# Altium schematic sheet main.SchDoc
size A3
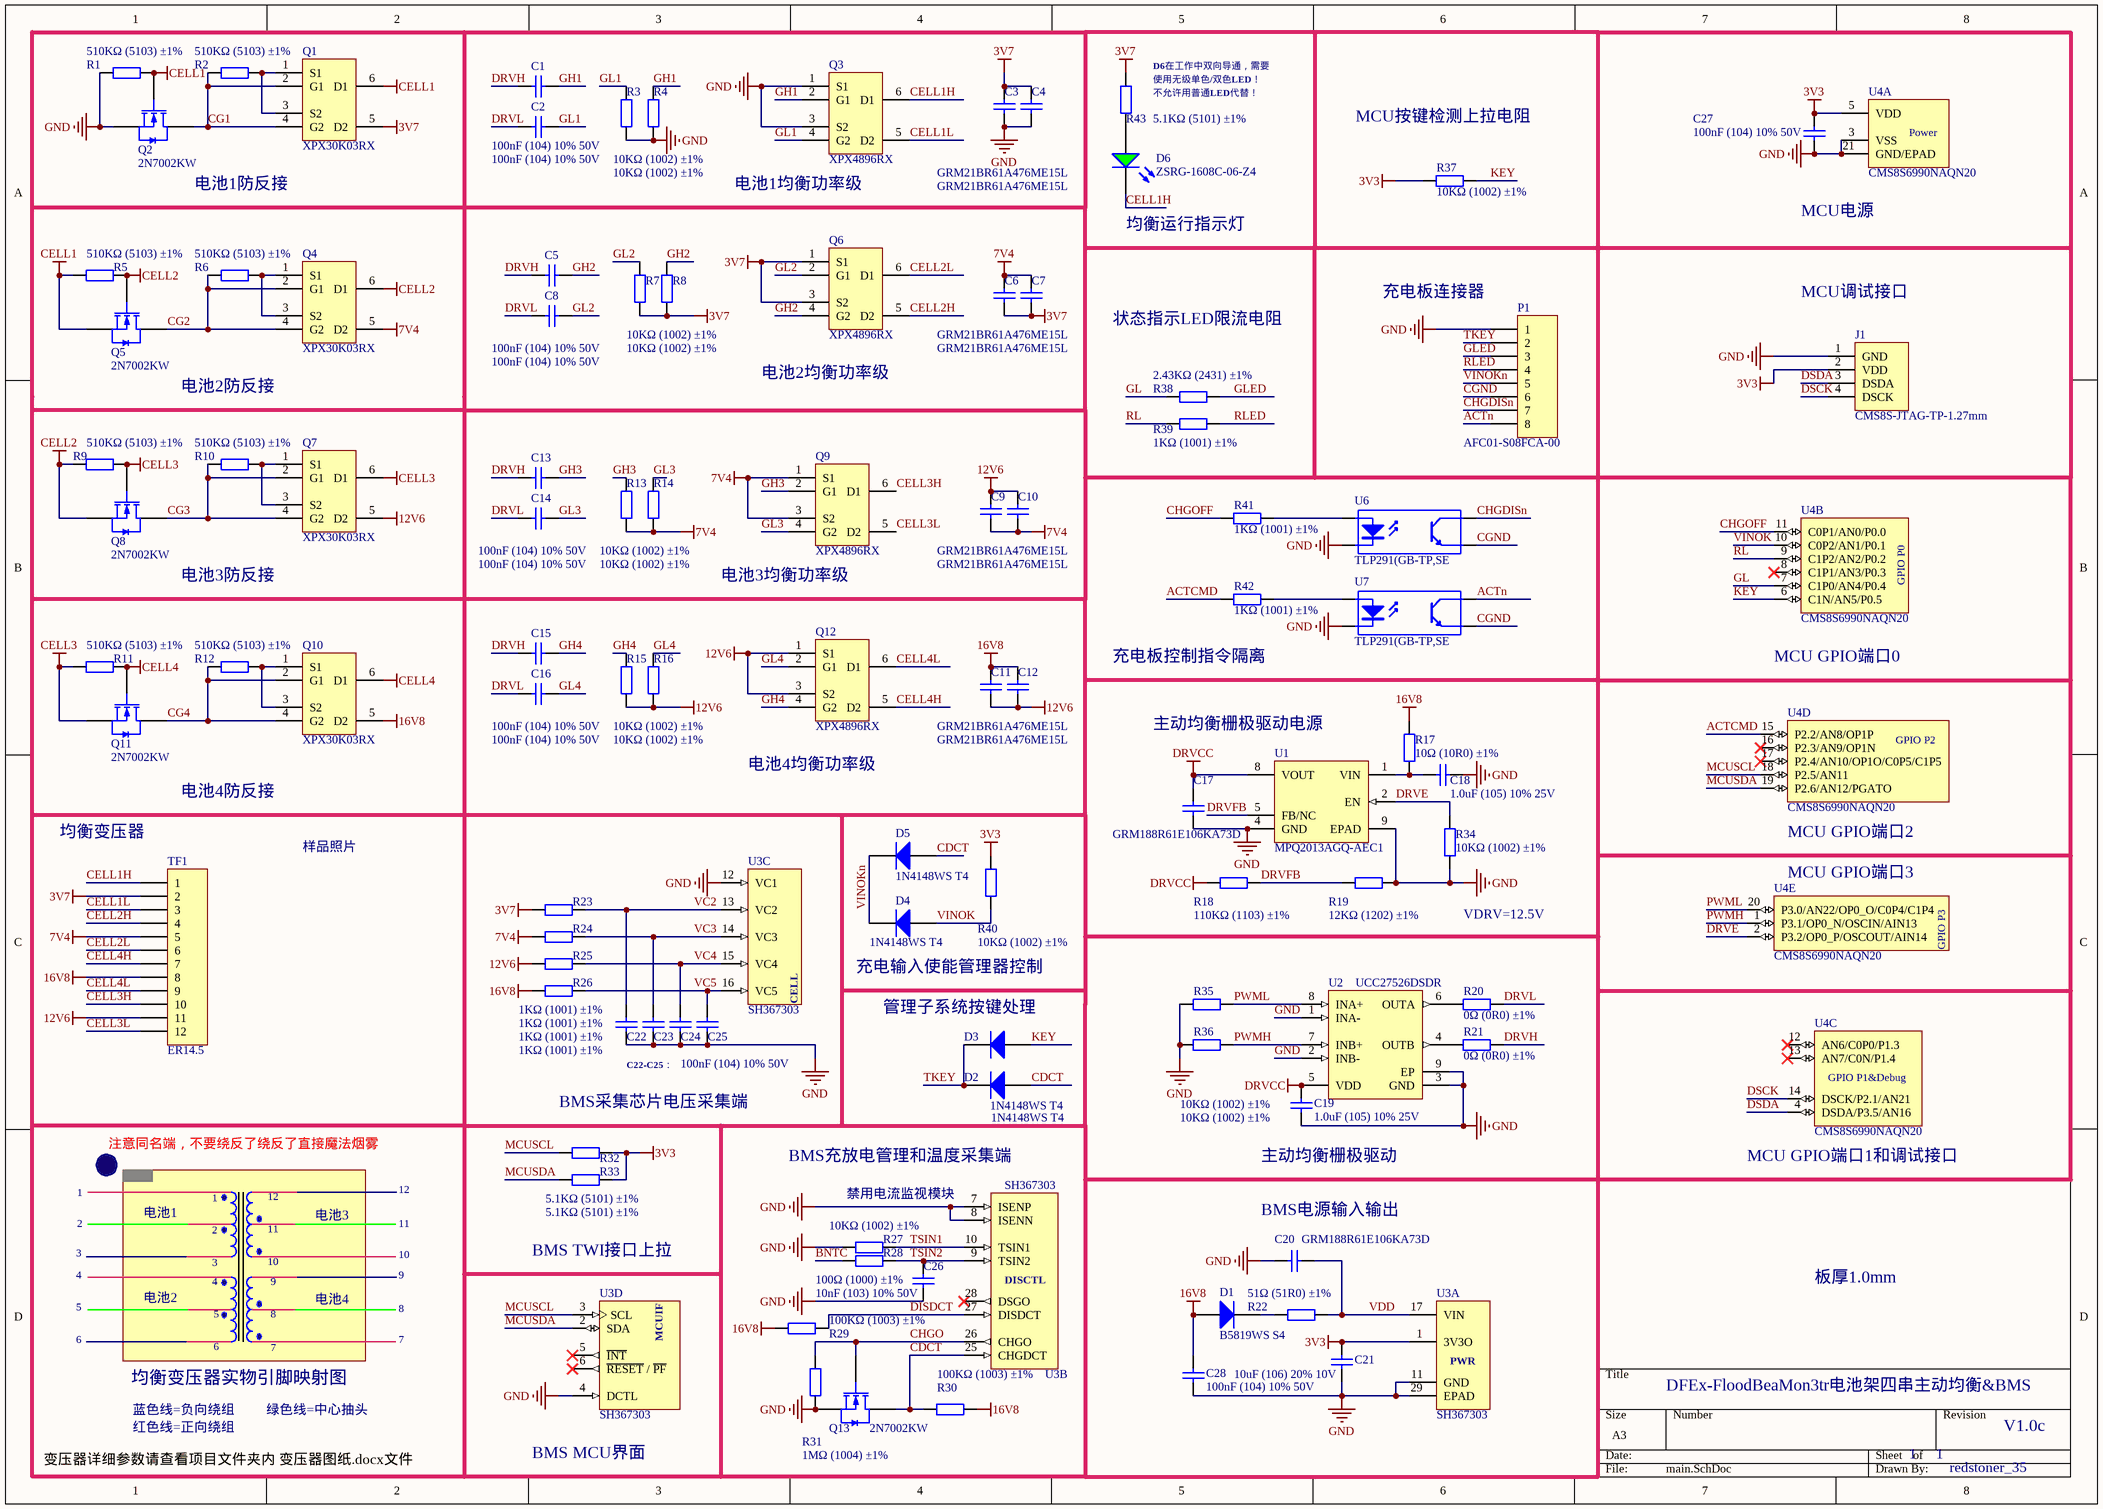
[diagram p0: main.SchDoc]

## Parts
C1  100nF (104) 10% 50V  [0402_C]
C2  100nF (104) 10% 50V  [0402_C]
C3  GRM21BR61A476ME15L  [0805_C]
C4  GRM21BR61A476ME15L  [0805_C]
C5  100nF (104) 10% 50V  [0402_C]
C6  GRM21BR61A476ME15L  [0805_C]
C7  GRM21BR61A476ME15L  [0805_C]
C8  100nF (104) 10% 50V  [0402_C]
C9  GRM21BR61A476ME15L  [0805_C]
C10  GRM21BR61A476ME15L  [0805_C]
C11  GRM21BR61A476ME15L  [0805_C]
C12  GRM21BR61A476ME15L  [0805_C]
C13  100nF (104) 10% 50V  [0402_C]
C14  100nF (104) 10% 50V  [0402_C]
C15  100nF (104) 10% 50V  [0402_C]
C16  100nF (104) 10% 50V  [0402_C]
C17  GRM188R61E106KA73D  [0603_C]
C18  1.0uF (105) 10% 25V  [0402_C]
C19  1.0uF (105) 10% 25V  [0402_C]
C20  GRM188R61E106KA73D  [0603_C]
C21  10uF (106) 20% 10V  [0402_C]
C22  100nF (104) 10% 50V  [0402_C]
C23  100nF (104) 10% 50V  [0402_C]  (value not drawn)
C24  100nF (104) 10% 50V  [0402_C]  (value not drawn)
C25  100nF (104) 10% 50V  [0402_C]  (value not drawn)
C26  10nF (103) 10% 50V  [0402_C]
C27  100nF (104) 10% 50V  [0402_C]
C28  100nF (104) 10% 50V  [0402_C]
D1  B5819WS S4  [SOD-323]
D2  1N4148WS T4  [SOD-323]
D3  1N4148WS T4  [SOD-323]
D4  1N4148WS T4  [SOD-323]
D5  1N4148WS T4  [SOD-323]
D6  ZSRG-1608C-06-Z4  [0603_LED_S1]
J1  CMS8S-JTAG-TP-1.27mm  [CMS8S-JTAG-TP-1.27]
P1  AFC01-S08FCA-00  [FPC0.5 2H-WS-8P]
Q1  XPX30K03RX  [EDFN3x3]
Q2  2N7002KW  [SC70-3]
Q3  XPX4896RX  [EDFN3x3]
Q4  XPX30K03RX  [EDFN3x3]
Q5  2N7002KW  [SC70-3]
Q6  XPX4896RX  [EDFN3x3]
Q7  XPX30K03RX  [EDFN3x3]
Q8  2N7002KW  [SC70-3]
Q9  XPX4896RX  [EDFN3x3]
Q10  XPX30K03RX  [EDFN3x3]
Q11  2N7002KW  [SC70-3]
Q12  XPX4896RX  [EDFN3x3]
Q13  2N7002KW  [SC70-3]
R1  510KΩ (5103) ±1%  [0402_R]
R2  510KΩ (5103) ±1%  [0402_R]
R3  10KΩ (1002) ±1%  [0402_R]
R4  10KΩ (1002) ±1%  [0402_R]
R5  510KΩ (5103) ±1%  [0402_R]
R6  510KΩ (5103) ±1%  [0402_R]
R7  10KΩ (1002) ±1%  [0402_R]
R8  10KΩ (1002) ±1%  [0402_R]
R9  510KΩ (5103) ±1%  [0402_R]
R10  510KΩ (5103) ±1%  [0402_R]
R11  510KΩ (5103) ±1%  [0402_R]
R12  510KΩ (5103) ±1%  [0402_R]
R13  10KΩ (1002) ±1%  [0402_R]
R14  10KΩ (1002) ±1%  [0402_R]
R15  10KΩ (1002) ±1%  [0402_R]
R16  10KΩ (1002) ±1%  [0402_R]
R17  10Ω (10R0) ±1%  [0402_R]
R18  110KΩ (1103) ±1%  [0402_R]
R19  12KΩ (1202) ±1%  [0402_R]
R20  0Ω (0R0) ±1%  [0402_R]
R21  0Ω (0R0) ±1%  [0402_R]
R22  51Ω (51R0) ±1%  [0603_R]
R23  1KΩ (1001) ±1%  [0402_R]
R24  1KΩ (1001) ±1%  [0402_R]
R25  1KΩ (1001) ±1%  [0402_R]
R26  1KΩ (1001) ±1%  [0402_R]
R27  10KΩ (1002) ±1%  [0402_R]
R28  100Ω (1000) ±1%  [0402_R]
R29  100KΩ (1003) ±1%  [0402_R]
R30  100KΩ (1003) ±1%  [0402_R]
R31  1MΩ (1004) ±1%  [0402_R]
R32  5.1KΩ (5101) ±1%  [0402_R]
R33  5.1KΩ (5101) ±1%  [0402_R]
R34  10KΩ (1002) ±1%  [0402_R]
R35  10KΩ (1002) ±1%  [0402_R]
R36  10KΩ (1002) ±1%  [0402_R]
R37  10KΩ (1002) ±1%  [0402_R]
R38  2.43KΩ (2431) ±1%  [0402_R]
R39  1KΩ (1001) ±1%  [0402_R]
R40  10KΩ (1002) ±1%  [0402_R]
R41  1KΩ (1001) ±1%  [0402_R]
R42  1KΩ (1001) ±1%  [0402_R]
R43  5.1KΩ (5101) ±1%  [0402_R]
TF1  ER14.5  [ER14.5 SMT6+6]
U1  MPQ2013AGQ-AEC1  [MPQ2013A-QFN8]
U2  UCC27526DSDR  [DSD0008D]
U3  SH367303  [QFN28-5x5]  (parts A,B,C,D of 4)
U4  CMS8S6990NAQN20  [QFN40P300X300X800_HS-21N]  (parts A,B,C,D,E of 5)
U6  TLP291(GB-TP,SE  [SOP127P700X210-4M]
U7  TLP291(GB-TP,SE  [SOP127P700X210-4M]

## Blocks framed on the sheet
电池1防反接: Q1 Q2 R1 R2

## Nets
3V3: C21.2 C27.2 J1.2(VDD) R32.2 R33.2 R37.1 R40.2 U3.1(3V3O) U4.5(VDD)
3V7: C3.2 C4.2 C6.1 C7.1 Q1.5(D2) Q6.1(S1) Q6.3(S2) R7.1 R8.1 R23.1 R43.2 TF1.2
7V4: C6.2 C7.2 C9.1 C10.1 Q4.5(D2) Q9.1(S1) Q9.3(S2) R13.1 R14.1 R24.1 TF1.5
12V6: C9.2 C10.2 C11.1 C12.1 Q7.5(D2) Q12.1(S1) Q12.3(S2) R15.1 R16.1 R25.1 TF1.11
16V8: C11.2 C12.2 C28.2 D1.1(A) Q10.5(D2) R17.2 R26.1 R29.1 R30.1 TF1.8
CELL1: Q1.6(D1) Q2.1(G) Q5.2(S) R1.2 R5.1
CELL2: Q4.6(D1) Q5.1(G) Q8.2(S) R5.2 R9.1
CELL3: Q7.6(D1) Q8.1(G) Q11.2(S) R9.2 R11.1
CELL4: Q10.6(D1) Q11.1(G) R11.2
DRVCC: C17.2 C19.2 R18.1 U1.8(VOUT) U2.5(VDD)
GND: C3.1 C4.1 C17.1 C18.2 C19.1 C20.1 C21.1 C22.1 C23.1 C24.1 C25.1 C26.1 C27.1 C28.1 J1.1(GND) P1.1 Q2.2(S) Q3.1(S1) Q3.3(S2) Q13.2(S) R1.1 R3.2 R4.2 R19.2 R27.2 R31.1 R34.1 R35.2 R36.2 U1.4(GND) U1.9(EPAD) U2.1(INA-) U2.2(INB-) U2.3(GND) U2.9(EP) U3.4(DCTL) U3.7(ISENP) U3.8(ISENN) U3.11(GND) U3.12(VC1) U3.29(EPAD) U4.3(VSS) U4.21(GND/EPAD) U6.2(K) U7.2(K)
ACTCMD: R42.1 U4.15(P2.2/AN8/OP1P)
ACTn: P1.8 U7.4(C)
BNTC: R28.1
CDCT: D2.1(A) D5.1(A) Q13.3(D) R30.2 U3.25(CHGDCT)
CELL1H: D6.K Q3.6(D1) TF1.1
CELL1L: Q3.5(D2) TF1.3
CELL2H: Q6.5(D2) TF1.4
CELL2L: Q6.6(D1) TF1.6
CELL3H: Q9.6(D1) TF1.10
CELL3L: Q9.5(D2) TF1.12
CELL4H: Q12.5(D2) TF1.7
CELL4L: Q12.6(D1) TF1.9
CG1: Q1.2(G1) Q1.4(G2) Q2.3(D) R2.1
CG2: Q4.2(G1) Q4.4(G2) Q5.3(D) R6.1
CG3: Q7.2(G1) Q7.4(G2) Q8.3(D) R10.1
CG4: Q10.2(G1) Q10.4(G2) Q11.3(D) R12.1
CGND: P1.6 U6.3(E) U7.3(E)
CHGDISn: P1.7 U6.4(C)
CHGO: Q13.1(G) R31.2 U3.26(CHGO)
CHGOFF: R41.1 U4.11(C0P1/AN0/P0.0)
DISDCT: R29.2 U3.27(DISDCT)
DRVE: R34.2 U1.2(EN) U4.2(P3.2/OP0_P/OSCOUT/AIN14)
DRVFB: R18.2 R19.1 U1.5(FB/NC)
DRVH: C1.1 C5.1 C13.1 C15.1 R21.2
DRVL: C2.1 C8.1 C14.1 C16.1 R20.2
DSCK: J1.4(DSCK) U4.14(DSCK/P2.1/AN21)
DSDA: J1.3(DSDA) U4.4(DSDA/P3.5/AN16)
GH1: C1.2 Q3.2(G1) R4.1
GH2: C5.2 Q6.4(G2) R8.2
GH3: C13.2 Q9.2(G1) R13.2
GH4: C15.2 Q12.4(G2) R15.2
GL: R38.1 U4.7(C1P0/AN4/P0.4)
GL1: C2.2 Q3.4(G2) R3.1
GL2: C8.2 Q6.2(G1) R7.2
GL3: C14.2 Q9.4(G2) R14.2
GL4: C16.2 Q12.2(G1) R16.2
GLED: P1.3 R38.2
KEY: D3.1(A) R37.2 U4.6(C1N/AN5/P0.5)
MCUSCL: R32.1 U3.3(SCL) U4.18(P2.5/AN11)
MCUSDA: R33.1 U3.2(SDA) U4.19(P2.6/AN12/PGATO)
PWMH: R36.1 U2.7(INB+) U4.1(P3.1/OP0_N/OSCIN/AIN13)
PWML: R35.1 U2.8(INA+) U4.20(P3.0/AN22/OP0_O/C0P4/C1P4)
RL: R39.1 U4.9(C1P2/AN2/P0.2)
RLED: P1.4 R39.2
TKEY: D2.2(K) D3.2(K) P1.2
TSIN1: R27.1 U3.10(TSIN1)
TSIN2: C26.2 R28.2 U3.9(TSIN2)
VC2: C22.2 R23.2 U3.13(VC2)
VC3: C23.2 R24.2 U3.14(VC3)
VC4: C24.2 R25.2 U3.15(VC4)
VC5: C25.2 R26.2 U3.16(VC5)
VDD: C20.2 R22.2 U3.17(VIN)
VINOK: D4.1(A) R40.1 U4.10(C0P2/AN1/P0.1)
VINOKn: D4.2(K) D5.2(K) P1.5
NetC18_1: C18.1 R17.1 U1.1(VIN)
NetD1_2: D1.2(K) R22.1
NetD6_A: D6.A R43.1
NetQ1_1: Q1.1(S1) Q1.3(S2) R2.2
NetQ4_1: Q4.1(S1) Q4.3(S2) R6.2
NetQ7_1: Q7.1(S1) Q7.3(S2) R10.2
NetQ10_1: Q10.1(S1) Q10.3(S2) R12.2
NetR20_1: R20.1 U2.6(OUTA)
NetR21_1: R21.1 U2.4(OUTB)
NetR41_2: R41.2 U6.1(A)
NetR42_2: R42.2 U7.1(A)

Not connected (* = marked no-connect by the designer): U3 5(~{INT})* 6(~{RESET}_/_~{PF})* 28(DSGO)*; U4 8(C1P1/AN3/P0.3)* 12(AN6/C0P0/P1.3)* 13(AN7/C0N/P1.4)* 16(P2.3/AN9/OP1N)* 17(P2.4/AN10/OP1O/C0P5/C1P5)*

## Notes on the sheet
- (near R43) D6在工作中双向导通，需要
- (near R43) 使用无级单色/双色LED！
- (near R43) 不允许用普通LED代替！
- MCU按键检测上拉电阻
- (near Q3) 电池1均衡功率级
- (near D6) 均衡运行指示灯
- MCU电源
- 充电板连接器
- MCU调试接口
- (near Q6) 电池2均衡功率级
- 状态指示LED限流电阻
- 电池2防反接
- 电池3防反接
- (near Q9) 电池3均衡功率级
- 充电板控制指令隔离
- (near U4) MCU GPIO端口0
- (near Q12) 电池4均衡功率级
- 主动均衡栅极驱动电源
- 均衡变压器
- 电池4防反接
- 样品照片
- (near U4) MCU GPIO端口2
- VDRV=12.5V
- (near U4) MCU GPIO端口3
- (near D4) 充电输入使能管理器控制
- (near D3) 管理子系统按键处理
- BMS采集芯片电压采集端
- C22-C25：
- 注意同名端，不要绕反了绕反了直接魔法烟雾
- 12
- BMS充放电管理和温度采集端
- (near C19) 主动均衡栅极驱动
- (near U4) MCU GPIO端口1和调试接口
- 3
- 1
- 2
- 电池1
- 11
- 电池3
- 10
- BMS TWI接口上拉
- 禁用电流监视模块
- (near C20) BMS电源输入输出
- 4
- 5
- 电池2
- 8
- 9
- 电池4
- 板厚1.0mm
- 6
- 均衡变压器实物引脚映射图
- 7
- DFEx-FloodBeaMon3tr电池架四串主动均衡&BMS
- 变压器详细参数请查看项目文件夹内 变压器图纸.docx文件
- 蓝色线=负向绕组
- 红色线=正向绕组
- 绿色线=中心抽头
- (near U3) BMS MCU界面
- V1.0c
- redstoner_35
- (in symbol CM8S6990NA-QFN20, part A) Power
- (in symbol CM8S6990NA-QFN20, part B) GPIO P0
- (in symbol CM8S6990NA-QFN20, part C) GPIO P1&Debug
- (in symbol CM8S6990NA-QFN20, part D) GPIO P2
- (in symbol CM8S6990NA-QFN20, part E) GPIO P3
- (in symbol SH367303, part A) PWR
- (in symbol SH367303, part B) DISCTL
- (in symbol SH367303, part C) CELL
- (in symbol SH367303, part D) MCUIF

## Library data of the parts
C1 C2 C5 C8 C13-C16 C22-C25 C27 C28 = 0402 100nF (104) 10% 16V: 贴片电容; ComponentLink1Description: 供应商链接; ComponentLink1URL: http://www.szlcsc.com/product/details_1877.html; Package: 0402; Supplier: LC; SuppliersPartNumber: C1525
C3 C4 C6 C7 C9-C12 = 0805 22uF (226) 20% 25V: 贴片MLCC电容，47uF (476) 20% 10V; ComponentLink1Description: 供应商链接; ComponentLink1URL: http://www.szlcsc.com/product/details_46786.html; Package: 0805; Supplier: LC; SuppliersPartNumber: C45783
C17 = 0603 10uF (106) 10% 10V: 0603贴片MLCC电容 10uF ±20% 25V X5R; ComponentLink1Description: 供应商链接; ComponentLink1URL: http://www.szlcsc.com/product/details_20411.html; Package: 0603; Supplier: LC; SuppliersPartNumber: C19702
C18 C19 = 0402 1.0uF (105) 10% 25V: 贴片电容; ComponentLink1Description: 供应商链接; ComponentLink1URL: http://www.szlcsc.com/product/details_53938.html; Package: 0402; Supplier: LC; SuppliersPartNumber: C52923
C20 = 0603 2.2uF (225) 10% 16V: 0603贴片MLCC电容 10uF ±20% 25V X5R; ComponentLink1Description: 供应商链接; ComponentLink1URL: http://www.szlcsc.com/product/details_24366.html; Package: 0603; Supplier: LC; SuppliersPartNumber: C23630
C21 = 0402 10uF (106) 20% 6.3V: 贴片电容; ComponentLink1Description: 供应商链接; ComponentLink1URL: http://www.szlcsc.com/product/details_16204.html; Package: 0402; Supplier: LC; SuppliersPartNumber: C15525
C26 = 0402 10nF (103) 10% 50V: 贴片电容; ComponentLink1Description: 供应商链接; ComponentLink1URL: http://www.szlcsc.com/product/details_15869.html; Package: 0402; Supplier: LC; SuppliersPartNumber: C15195
D1-D5 = SOD-323 1N4148WS T4: 二极管; ComponentLink1Description: 供应商链接; ComponentLink1URL: http://www.szlcsc.com/product/details_2485.html; Package: SOD-323; Supplier: LC; SuppliersPartNumber: C2128
D6 = 0603 绿灯: 发光二极管 红绿无级双色; ComponentLink1Description: 供应商链接; ComponentLink1URL: http://www.szlcsc.com/product/details_73152.html; Package: 0603; Supplier: LC; SuppliersPartNumber: C72043
J1 = CMS8S-JTAG-TP-1.27mm: 面向CMS8S6990NA单片机的调试贴片触点，并不是元器件实物
P1 = CON 8: 翻盖式下接FPC/FFC连接器 P数:8P 间距:0.5mm; LatestRevisionDate: 17-Jul-2002; LatestRevisionNote: Re-released for DXP Platform.; Publisher: Altium Limited
Q1 Q4 Q7 Q10 = XPX10H03RX: 双P沟道MOSFET, DFN3x3 -20V -30A 12mΩ
Q2 Q5 Q8 Q11 Q13 = 2N7002 7002: 单N沟道MOSFET(场效应管); ComponentLink1Description: 供应商链接; ComponentLink1URL: http://www.szlcsc.com/product/details_9040.html; Package: SOT-323; Supplier: LC; SuppliersPartNumber: C???????
Q3 Q6 Q9 Q12 = XPX10H03RX: 双N沟道MOSFET, DFN3x3 40V 45A 7.2mΩ
R1 R2 R5 R6 R9-R12 = 0402 510KΩ (5103) 1%: 贴片电阻; ComponentLink1Description: 供应商链接; ComponentLink1URL: http://www.szlcsc.com/product/details_12170.html; Package: 0402; Supplier: LC; SuppliersPartNumber: C11616
R3 R4 R7 R8 R13-R16 R27 R34-R37 R40 = 0402 10KΩ (1002) 1%: 贴片电阻; ComponentLink1Description: 供应商链接; ComponentLink1URL: http://www.szlcsc.com/product/details_26487.html; Package: 0402; Supplier: LC; SuppliersPartNumber: C25744
R17 = 0402 10Ω (10R0) 1%: 贴片电阻; ComponentLink1Description: 供应商链接; ComponentLink1URL: http://www.szlcsc.com/product/details_25820.html; Package: 0402; Supplier: LC; SuppliersPartNumber: C25077
R18 R29 R30 = 0402 100KΩ (1003) 1%: 贴片电阻; ComponentLink1Description: 供应商链接; ComponentLink1URL: http://www.szlcsc.com/product/details_26484.html; Package: 0402; Supplier: LC; SuppliersPartNumber: C25741
R19 = 0402 12KΩ (1202) 1%: 贴片电阻; ComponentLink1Description: 供应商链接; ComponentLink1URL: http://www.szlcsc.com/product/details_26495.html; Package: 0402; Supplier: LC; SuppliersPartNumber: C25752
R20 R21 = 0402 0Ω (0R0) 1%: 贴片电阻; ComponentLink1Description: 供应商链接; ComponentLink1URL: http://www.szlcsc.com/product/details_17853.html; Package: 0402; Supplier: LC; SuppliersPartNumber: C17168
R22 = 0603 51Ω (51R0) 1%: 贴片电阻; ComponentLink1Description: 供应商链接; ComponentLink1URL: http://www.szlcsc.com/product/details_23924.html; Package: 0603; Supplier: LC; SuppliersPartNumber: C23197
R23-R26 R39 R41 R42 = 0402 1KΩ (1001) 1%: 贴片电阻; ComponentLink1Description: 供应商链接; ComponentLink1URL: http://www.szlcsc.com/product/details_12256.html; Package: 0402; Supplier: LC; SuppliersPartNumber: C11702
R28 = 0402 100Ω (1000) 1%: 贴片电阻; ComponentLink1Description: 供应商链接; ComponentLink1URL: http://www.szlcsc.com/product/details_25819.html; Package: 0402; Supplier: LC; SuppliersPartNumber: C25076
R31 = 0402 1MΩ (1004) 1%: 贴片电阻; ComponentLink1Description: 供应商链接; ComponentLink1URL: http://www.szlcsc.com/product/details_26826.html; Package: 0402; Supplier: LC; SuppliersPartNumber: C26083
R32 R33 = 0402 5.1KΩ (5101) 1%: 贴片电阻; ComponentLink1Description: 供应商链接; ComponentLink1URL: http://www.szlcsc.com/product/details_26648.html; Package: 0402; Supplier: LC; SuppliersPartNumber: C25905
R38 R43 = 0402 2KΩ (2001) 1%: 贴片电阻; ComponentLink1Description: 供应商链接; ComponentLink1URL: http://www.szlcsc.com/product/details_4516.html; Package: 0402; Supplier: LC; SuppliersPartNumber: C4109
TF1 = CON 12: ER14.5定制均衡变压器，PC40磁芯; LatestRevisionDate: 17-Jul-2002; LatestRevisionNote: Re-released for DXP Platform.; Publisher: Altium Limited
U1 = MPQ2013AGQ-xx-AEC1: MPS 40V LDO with Enable pin QFN3x3 package
U2 = UCC27526DSDR: 双路18V 5A峰值电流低侧栅极驱动器，WSON-8封装尺寸
U3 = SH367303: 3至5串锂离子电池BMS模拟前端，具备充放电控制/电压采集和I2C接口
U4 = CM8S6990NA-QFN20: 增强型闪存1T 8051单片机，16KB Flash 256+1K XRAM
U6 U7 = Optoisolator1: DC输入光电耦合隔离器，线性输入输出，隔离电压(rms):3750V SOP-4小型封装; Published: 24-Mar-1999; LatestRevisionDate: 04-Mar-2005; LatestRevisionNote: Sch pins 3 & 4 Swapped.; DatasheetVersion: Nov-2003; PackageReference: DIP-4; Publisher: Altium Limited